# Altium schematic sheet S3220A3.SchDoc: Modem BG95
size A3; Revision: A; SheetNumber: 3; SheetTotal: 5
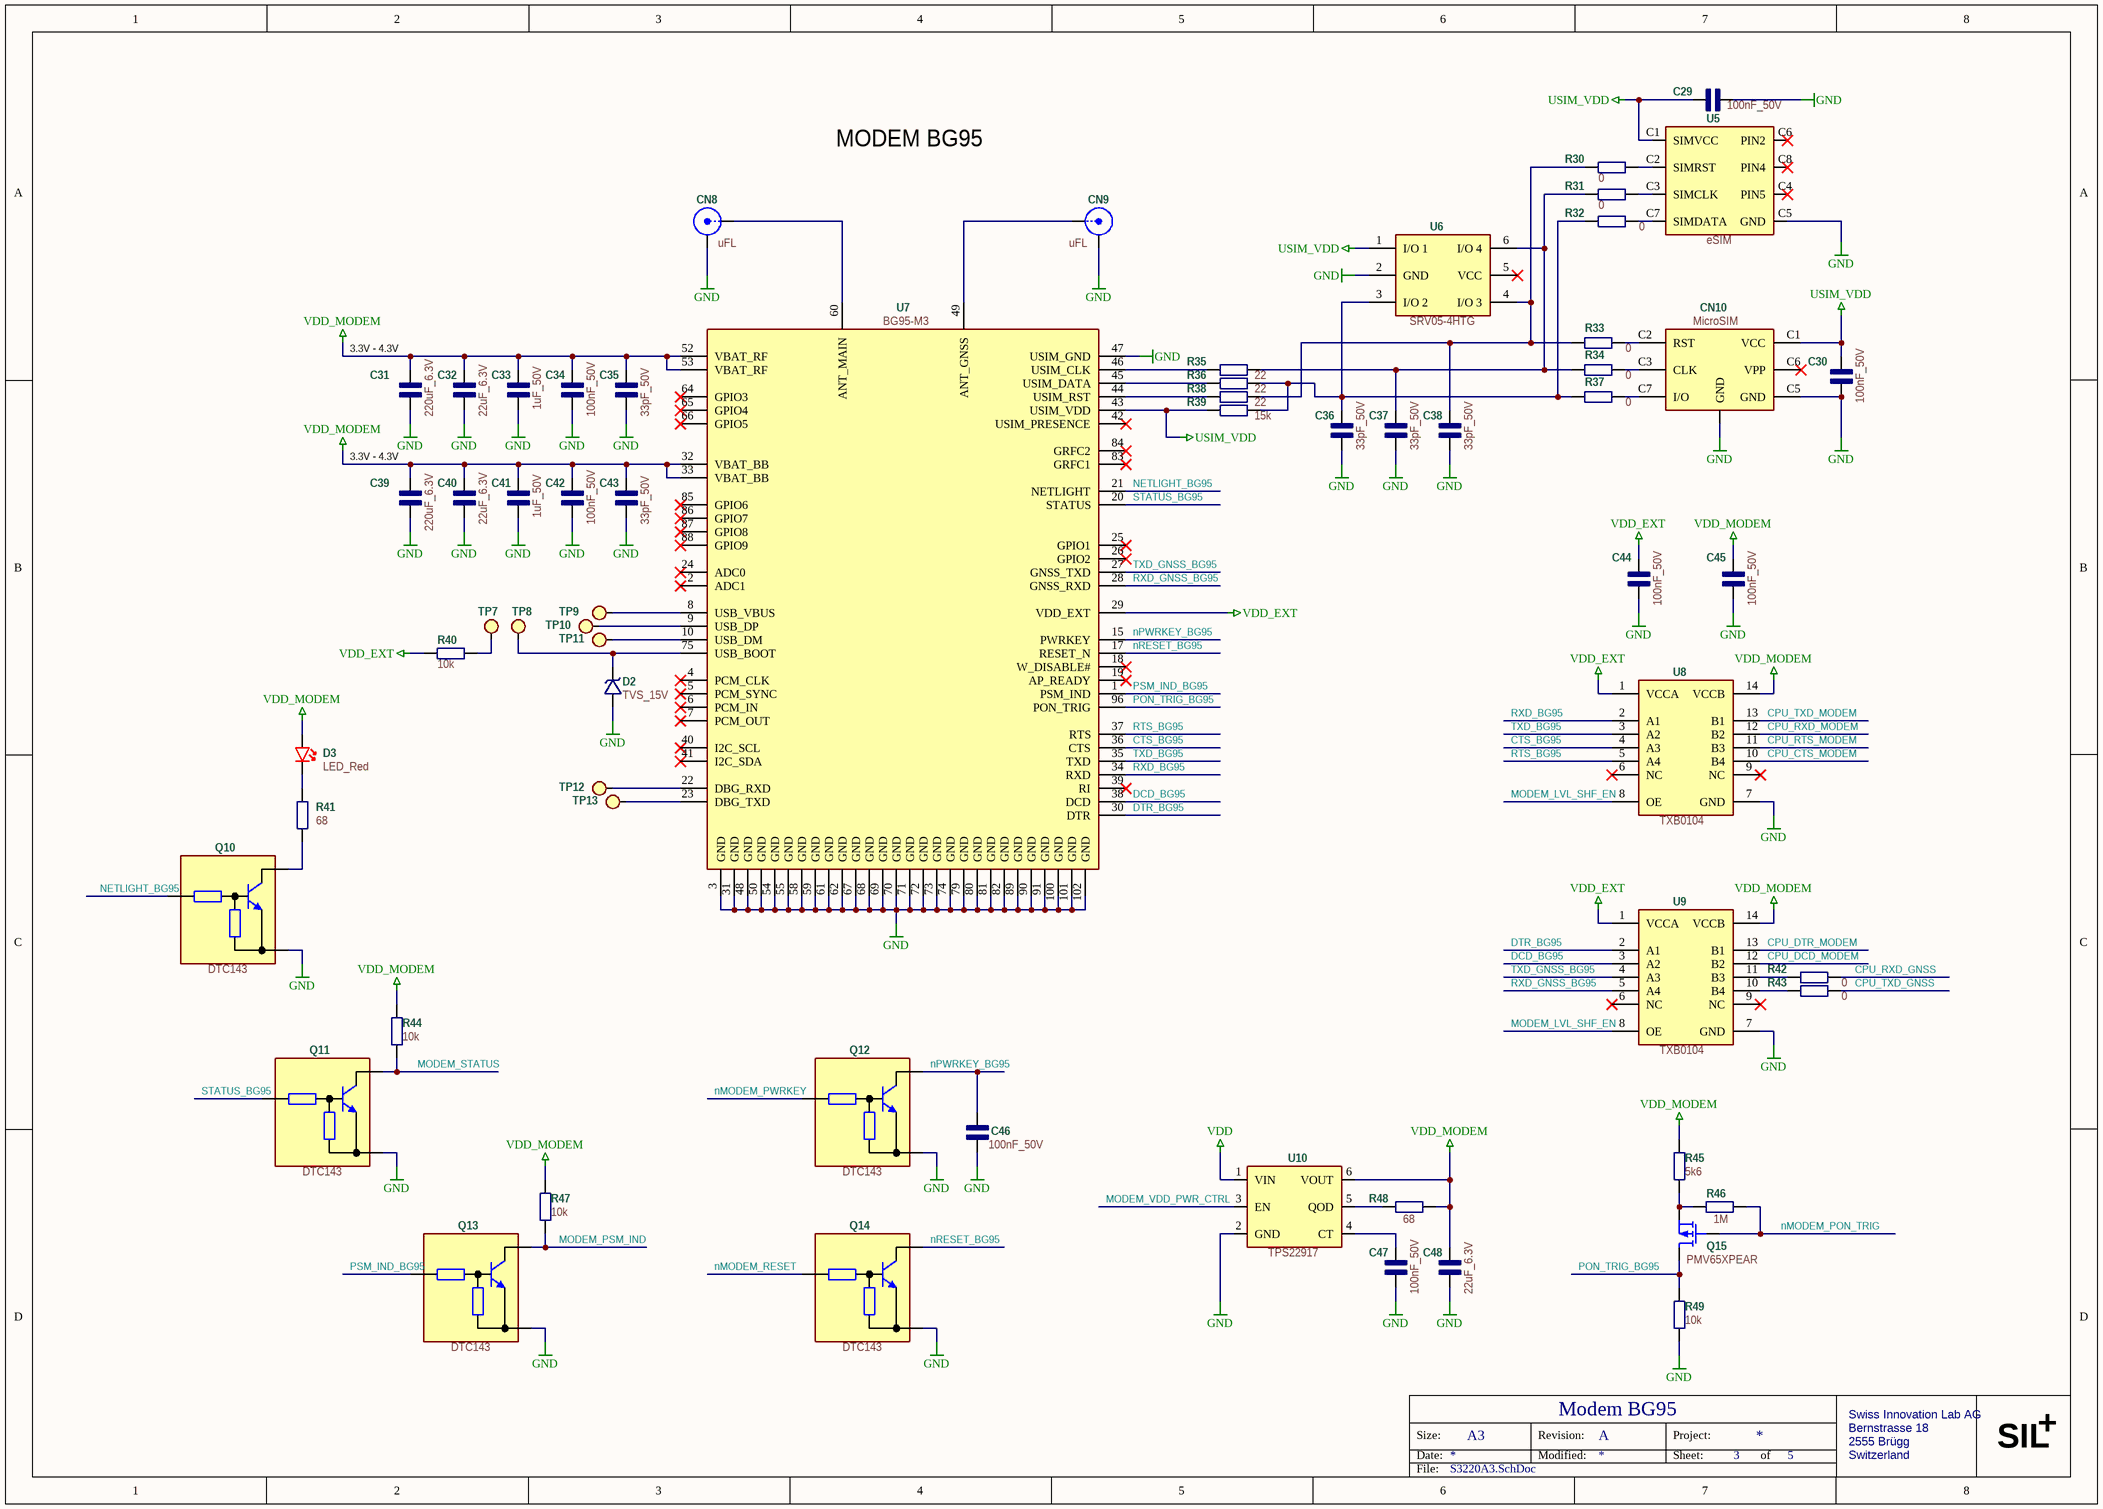
[diagram p0: S3220A3.SchDoc]

## Parts
C29  100nF_50V  [C_0603]
C30  100nF_50V  [C_0603]
C31  220uF_6.3V  [C_1206]
C32  22uF_6.3V  [C_0603]
C33  1uF_50V  [C_0603]
C34  100nF_50V  [C_0603]
C35  33pF_50V  [C_0603]
C36  33pF_50V  [C_0603]
C37  33pF_50V  [C_0603]
C38  33pF_50V  [C_0603]
C39  220uF_6.3V  [C_1206]
C40  22uF_6.3V  [C_0603]
C41  1uF_50V  [C_0603]
C42  100nF_50V  [C_0603]
C43  33pF_50V  [C_0603]
C44  100nF_50V  [C_0603]
C45  100nF_50V  [C_0603]
C46  100nF_50V  [C_0603]
C47  100nF_50V  [C_0603]
C48  22uF_6.3V  [C_0603]
CN8  uFL  [CN_RF_uFL]
CN9  uFL  [CN_RF_uFL]
CN10  MicroSIM  [CN_MicroSIM-Holder]
D2  TVS_15V  [D_0603]
D3  LED_Red  [LED_0603]
Q10  DTC143  [Q_SOT-416]
Q11  DTC143  [Q_SOT-416]
Q12  DTC143  [Q_SOT-416]
Q13  DTC143  [Q_SOT-416]
Q14  DTC143  [Q_SOT-416]
Q15  PMV65XPEAR  [U_SOT23-3]
R30  0  [R_0603]
R31  0  [R_0603]
R32  0  [R_0603]
R33  0  [R_0603]
R34  0  [R_0603]
R35  22  [R_0603]
R36  22  [R_0603]
R37  0  [R_0603]
R38  22  [R_0603]
R39  15k  [R_0603]
R40  10k  [R_0603]
R41  68  [R_0603]
R42  0  [R_0603]
R43  0  [R_0603]
R44  10k  [R_0603]
R45  5k6  [R_0603]
R46  1M  [R_0603]
R47  10k  [R_0603]
R48  68  [R_0603]
R49  10k  [R_0603]
TP7  Test point  [TP_SMD_R1.0mm]  (value not drawn)  (no BOM)
TP8  Test point  [TP_SMD_R1.0mm]  (value not drawn)  (no BOM)
TP9  Test point  [TP_SMD_R1.0mm]  (value not drawn)  (no BOM)
TP10  Test point  [TP_SMD_R1.0mm]  (value not drawn)  (no BOM)
TP11  Test point  [TP_SMD_R1.0mm]  (value not drawn)  (no BOM)
TP12  Test point  [TP_SMD_R1.0mm]  (value not drawn)  (no BOM)
TP13  Test point  [TP_SMD_R1.0mm]  (value not drawn)  (no BOM)
U5  eSIM  [U_MFF2]
U6  SRV05-4HTG  [U_SOT23-6]
U7  BG95-M3  [U_BG96_BG95]
U8  TXB0104  [U_14-VQFN]
U9  TXB0104  [U_14-VQFN]
U10  TPS22917  [U_SOT23-6]

## Nets
GND: C29.1 C30.1 C31.1 C32.1 C33.2 C34.1 C35.1 C36.1 C37.1 C38.1 C39.1 C40.1 C41.2 C42.1 C43.1 C44.2 C45.2 C46.1 C47.1 C48.1 CN8.G CN9.G CN10.0(GND) CN10.C5(GND) D2.1 Q10.2(E) Q11.2(E) Q12.2(E) Q13.2(E) Q14.2(E) R49.2 U5.C5(GND) U6.2(GND) U7.3(GND) U7.31(GND) U7.47(USIM_GND) U7.48(GND) U7.50(GND) U7.54(GND) U7.55(GND) U7.58(GND) U7.59(GND) U7.61(GND) U7.62(GND) U7.67(GND) U7.68(GND) U7.69(GND) U7.70(GND) U7.71(GND) U7.72(GND) U7.73(GND) U7.74(GND) U7.79(GND) U7.80(GND) U7.81(GND) U7.82(GND) U7.89(GND) U7.90(GND) U7.91(GND) U7.100(GND) U7.101(GND) U7.102(GND) U8.7(GND) U9.7(GND) U10.2(GND)
USIM_VDD: C29.2 C30.2 CN10.C1(VCC) R39.1 U5.C1(SIMVCC) U6.1(I/O_1) U7.43(USIM_VDD)
VDD: U10.1(VIN)
VDD_EXT: C44.1 R40.1 U7.29(VDD_EXT) U8.1(VCCA) U9.1(VCCA)
VDD_MODEM: C31.2 C32.2 C33.1 C34.2 C35.2 C39.2 C40.2 C41.1 C42.2 C43.2 C45.1 C48.2 D3.1(A) R44.1 R45.2 R47.1 R48.2 U7.32(VBAT_BB) U7.33(VBAT_BB) U7.52(VBAT_RF) U7.53(VBAT_RF) U8.14(VCCB) U9.14(VCCB) U10.6(VOUT)
CPU_CTS_MODEM: U8.10(B4)
CPU_DCD_MODEM: U9.12(B2)
CPU_DTR_MODEM: U9.13(B1)
CPU_RTS_MODEM: U8.11(B3)
CPU_RXD_GNSS: R42.2
CPU_RXD_MODEM: U8.12(B2)
CPU_TXD_GNSS: R43.2
CPU_TXD_MODEM: U8.13(B1)
CTS_BG95: U7.36(CTS) U8.4(A3)
DCD_BG95: U7.38(DCD) U9.3(A2)
DTR_BG95: U7.30(DTR) U9.2(A1)
MODEM_LVL_SHF_EN: U8.8(OE) U9.8(OE)
MODEM_PSM_IND: Q13.3(C) R47.2
MODEM_STATUS: Q11.3(C) R44.2
MODEM_VDD_PWR_CTRL: U10.3(EN)
NETLIGHT_BG95: Q10.1(B) U7.21(NETLIGHT)
nMODEM_PON_TRIG: Q15.1(G) R46.1
nMODEM_PWRKEY: Q12.1(B)
nMODEM_RESET: Q14.1(B)
nPWRKEY_BG95: C46.2 Q12.3(C) U7.15(PWRKEY)
nRESET_BG95: Q14.3(C) U7.17(RESET_N)
PON_TRIG_BG95: Q15.3(D) R49.1 U7.96(PON_TRIG)
PSM_IND_BG95: Q13.1(B) U7.1(PSM_IND)
RTS_BG95: U7.37(RTS) U8.5(A4)
RXD_BG95: U7.34(RXD) U8.2(A1)
RXD_GNSS_BG95: U7.28(GNSS_RXD) U9.5(A4)
STATUS_BG95: Q11.1(B) U7.20(STATUS)
TXD_BG95: U7.35(TXD) U8.3(A2)
TXD_GNSS_BG95: U7.27(GNSS_TXD) U9.4(A3)
NetC36_2: C36.2 R32.2 R36.2 R37.1 R39.2 U6.3(I/O_2)
NetC37_2: C37.2 R31.2 R34.1 R35.2 U6.6(I/O_4)
NetC38_2: C38.2 R30.2 R33.1 R38.2 U6.4(I/O_3)
NetC47_2: C47.2 U10.4(CT)
NetCN8_S: CN8.S U7.60(ANT_MAIN)
NetCN9_S: CN9.S U7.49(ANT_GNSS)
NetCN10_C2: CN10.C2(RST) R33.2
NetCN10_C3: CN10.C3(CLK) R34.2
NetCN10_C7: CN10.C7(I/O) R37.2
NetD2_2: D2.2 TP8.1 U7.75(USB_BOOT)
NetD3_2: D3.2(K) R41.2
NetQ10_3: Q10.3(C) R41.1
NetQ15_2: Q15.2(S) R45.1 R46.2
NetR30_1: R30.1 U5.C2(SIMRST)
NetR31_1: R31.1 U5.C3(SIMCLK)
NetR32_1: R32.1 U5.C7(SIMDATA)
NetR35_1: R35.1 U7.46(USIM_CLK)
NetR36_1: R36.1 U7.45(USIM_DATA)
NetR38_1: R38.1 U7.44(USIM_RST)
NetR40_2: R40.2 TP7.1
NetR42_1: R42.1 U9.11(B3)
NetR43_1: R43.1 U9.10(B4)
NetR48_1: R48.1 U10.5(QOD)
NetTP9_1: TP9.1 U7.8(USB_VBUS)
NetTP10_1: TP10.1 U7.9(USB_DP)
NetTP11_1: TP11.1 U7.10(USB_DM)
NetTP12_1: TP12.1 U7.22(DBG_RXD)
NetTP13_1: TP13.1 U7.23(DBG_TXD)

Not connected (* = marked no-connect by the designer): CN10 C6(VPP)* X1 X2; U5 C4(PIN5)* C6(PIN2)* C8(PIN4)* NC; U6 5(VCC)*; U7 2(ADC1)* 4(PCM_CLK)* 5(PCM_SYNC)* 6(PCM_IN)* 7(PCM_OUT)* 11(RESERVED) 12(RESERVED) 13(RESERVED) 14(RESERVED) 16(RESERVED) 18(W_DISABLE#)* 19(AP_READY)* 24(ADC0)* 25(GPIO1)* 26(GPIO2)* 39(RI)* 40(I2C_SCL)* 41(I2C_SDA)* 42(USIM_PRESENCE)* 51(RESERVED) 56(RESERVED) 57(RESERVED) 63(RESERVED) 64(GPIO3)* 65(GPIO4)* 66(GPIO5)* 76(RESERVED) 77(RESERVED) 78(RESERVED) 83(GRFC1)* 84(GRFC2)* 85(GPIO6)* 86(GPIO7)* 87(GPIO8)* 88(GPIO9)* 92(RESERVED) 93(RESERVED) 94(RESERVED) 95(RESERVED) 97(RESERVED) 98(RESERVED) 99(RESERVED); U8 6(NC)* 9(NC)*; U9 6(NC)* 9(NC)*

## Notes on the sheet
- MODEM BG95
- (near C31) 3.3V - 4.3V
- (near C39) 3.3V - 4.3V
- Size:
- Date:
- A3
- Revision:
- Modified:
- Project:
- Sheet:
- of
- Swiss Innovation Lab AG
- Bernstrasse 18
- 2555 Brügg
- Switzerland
- SIL
- +
- File:

## Library data of the parts
C29 C30 C34 C42 C44-C47 = C_100nF_50V: 0.1µF ±10% 50V Ceramic Capacitor X7R 0603 (1608 Metric); Manufacturer: TDK; Manufacturer Part Number: C1608X7R1H104K080AA; Value: 100nF; ValueAux: _50V; Currency: $; Price: 0,01309; Supplier 1: Digi-Key; Supplier Part Number 1: 445-1314-6-ND
C31 C39 = C_220uF_6.3V: 220µF ±20% 6.3V Ceramic Capacitor X5R 1206 (3216 Metric); Manufacturer: Murata Electronics North America; Manufacturer Part Number: GRM31CR60J227ME11L; Value: 220uF; ValueAux: _6.3V; Currency: $; Price: 0,59945; Supplier 1: Digi-Key; Supplier Part Number 1: 490-13970-1-ND
C32 C40 C48 = C_22uF_6V3: 22µF ±20% 6.3V Ceramic Capacitor X5R 0603 (1608 Metric); Manufacturer: Samsung Electro-Mechanics; Manufacturer Part Number: CL10A226MQ8NRNC; Value: 22uF; ValueAux: _6.3V; Currency: $; Price: 0,04566; Supplier 1: Digi-Key; Supplier Part Number 1: 1276-1193-1-ND
C33 C41 = C_1uF_50V: 1µF 50V Ceramic Capacitor X5R 0603 (1608 Metric) 0.063" L x 0.032" W (1.60mm x 0.80mm); Manufacturer: Samsung Electro-Mechanics; Manufacturer Part Number: CL10A105KB8NNNC; Value: 1uF; ValueAux: _50V; Currency: $; Price: 0,03472; Supplier 1: Digi-Key; Supplier Part Number 1: 1276-1860-1-ND
C35-C38 C43 = C_33pF_50V: 33pF ±1% 50V Ceramic Capacitor C0G, NP0 0603 (1608 Metric); Manufacturer: Samsung Electro-Mechanics; Manufacturer Part Number: CL10C330FB8NNNC; ValueAux: _50V; Currency: $; Value: 33pF; Price: 0,04166; Supplier 1: Digi-Key; Supplier Part Number 1: 1276-2262-6-ND
CN8 CN9 = CN_RF_uFL: Ultra Miniature Coaxial Connector Jack, Male Pin 50 Ohm Surface Mount Solder; Manufacturer: TE Connectivity AMP Connectors; Manufacturer Part Number: 1909763-1; Currency: $; Value: uFL; Price: 0,25410; Supplier 1: Digi-Key; Supplier Part Number 1: A118077CT-ND
CN10 = CN_MicroSIM-Holder: 6 Position Card Connector Micro SIM Surface Mount, Right Angle Gold; Manufacturer: Molex LLC; Manufacturer Part Number: 0788000001; Currency: $; Value: MicroSIM; Price: 1,14178; Supplier 1: Digi-Key; Supplier Part Number 1: WM9786CT-ND
D2 = D_TVS_15V: TVS DIODE 15V 27.4V DSN1608-2; Manufacturer: Nexperia USA Inc.; Manufacturer Part Number: PTVS15VZ1USKYL; ValueAux: _15V; Currency: $; Value: TVS; Price: 0,09950; Supplier 1: Digi-Key; Supplier Part Number 1: 1727-2745-6-ND
D3 = D_LED_R_5mA: Red 631nm LED Indication - Discrete 2V 0603; Manufacturer: Lite-On Inc.; Manufacturer Part Number: LTST-C193KRKT-5A; ValueAux: _Red; Currency: $; Value: LED; Price: 0,07565; Supplier 1: Digi-Key; Supplier Part Number 1: 160-1830-1-ND
Q10-Q14 = Q_DTC143: Pre-Biased Bipolar Transistor (BJT) NPN - Pre-Biased 50V 100mA  200mW Surface Mount SC-75, SOT-416; Manufacturer: ON Semiconductor; Manufacturer Part Number: DTC143ZET1G; Currency: $; Value: DTC143; Price: 0,03338; Supplier 1: Digi-Key; Supplier Part Number 1: DTC143ZET1GOSCT-ND
Q15 = Q_PMV65: P-Channel 20V 2.8A (Ta) 480mW (Ta), 6.25W (Tc) Surface Mount TO-236AB (SOT23); Manufacturer: Nexperia USA Inc.; Currency: $; Value: PMV65XPEAR; Manufacturer Part Number: PMV65XPEAR; Price: 0,11204; Supplier 1: Digi-Key; Supplier Part Number 1: 1727-2310-1-ND
R30-R34 R37 R42 R43 = R_0_1%: 0 Ohms Jumper 0.1W, 1/10W Chip Resistor 0603 (1608 Metric) Automotive AEC-Q200 Thick Film; Manufacturer: Panasonic Electronic Components; Manufacturer Part Number: ERJ-3GEY0R00V; Currency: $; Value: 0; Price: 0,00962; Supplier 1: Digi-Key; Supplier Part Number 1: P0.0GCT-ND
R35 R36 R38 = R_22_1%: 22 Ohms ±1% 0.1W, 1/10W Chip Resistor 0603 (1608 Metric) Automotive AEC-Q200 Thick Film; Manufacturer: Panasonic Electronic Components; Manufacturer Part Number: ERJ-3EKF22R0V; Currency: $; Value: 22; Price: 0,01153; Supplier 1: Digi-Key; Supplier Part Number 1: P22.0HCT-ND
R39 = R_15k_1%: 15 kOhms ±1% 0.1W, 1/10W Chip Resistor 0603 (1608 Metric) Automotive AEC-Q200, Moisture Resistant Thick Film; Manufacturer: Yageo; Manufacturer Part Number: AC0603FR-0715KL; Currency: $; Value: 15k; Price: 0,00527; Supplier 1: Digi-Key; Supplier Part Number 1: YAG3569DKR-ND
R40 R44 R47 R49 = R_10k_1%: 10 kOhms ±1% 0.1W, 1/10W Chip Resistor 0603 (1608 Metric) Automotive AEC-Q200 Thick Film; Manufacturer: Panasonic Electronic Components; Manufacturer Part Number: ERJ-3EKF1002V; Currency: $; Value: 10k; Price: 0,01449; Supplier 1: Digi-Key; Supplier Part Number 1: P10.0KHCT-ND
R41 R48 = R_68_1%: 68 Ohms ±1% 0.1W, 1/10W Chip Resistor 0603 (1608 Metric) Automotive AEC-Q200 Thick Film; Manufacturer: Panasonic Electronic Components; Manufacturer Part Number: ERJ-3EKF68R0V; Currency: $; Value: 68; Price: 0,01449; Supplier 1: Digi-Key; Supplier Part Number 1: P68.0HCT-ND
R45 = R_5k6_1%: 5.6 kOhms ±1% 0.1W, 1/10W Chip Resistor 0603 (1608 Metric) Automotive AEC-Q200 Thick Film; Manufacturer: Panasonic Electronic Components; Manufacturer Part Number: ERJ-3EKF5601V; Currency: $; Value: 5k6; Price: 0,01264; Supplier 1: Digi-Key; Supplier Part Number 1: P5.60KHCT-ND
R46 = R_1M_1%: 1 MOhms ±1% 0.1W, 1/10W Chip Resistor 0603 (1608 Metric) Automotive AEC-Q200 Thick Film; Manufacturer: Panasonic Electronic Components; Manufacturer Part Number: ERJ-3EKF1004V; Currency: $; Value: 1M; Price: 0,01264; Supplier 1: Digi-Key; Supplier Part Number 1: P1.00MHCT-ND
TP7-TP13 = TP_Test_point: Manufacturer: Swiss Innovation Lab; Currency: $; Value: Test point; Manufacturer Part Number: Test point; Price: 0
U5 = U_eSIM-M2M: M2M embedded SIM card IC; Manufacturer: 1NCE; Currency: $; Value: eSIM; Manufacturer Part Number: eSIM; Price: 12,0; Supplier 1: 1NCE; Supplier Part Number 1: eSIM
U6 = U_SRV05-4HTG: TVS DIODE 6V 15V SOT23-6; Manufacturer: Littelfuse Inc.; Currency: $; Value: SRV05-4HTG; Manufacturer Part Number: SRV05-4HTG; Price: 0,40556; Supplier 1: Digi-Key; Supplier Part Number 1: F4204CT-ND
U7 = U_BG95: MultiBand, 3GPP Rel.13, LTE Cat.M1/NB1, GSM/EGPRS, 3xUART, VoLTE; Manufacturer: Quectel; Currency: $; Value: BG95-M3; Manufacturer Part Number: BG95-M3; Price: 15,98590; Supplier 1: Codico; Supplier Part Number 1: BG95-M3
U8 U9 = U_TXB0104: Voltage Level Translator Bidirectional 1 Circuit 4 Channel 100Mbps 14-VQFN (3.5x3.5); Manufacturer: Texas Instruments; Manufacturer Part Number: TXB0104RGYR; Currency: $; Value: TXB0104; Price: 0,65817; Supplier 1: Digi-Key; Supplier Part Number 1: 296-21930-6-ND
U10 = U_TPS22917: Power Switch/Driver 1:1 P-Channel 2A SOT-23-6; Manufacturer: Texas Instruments; Manufacturer Part Number: TPS22917DBVR; Currency: $; Value: TPS22917; Price: 0,19065; Supplier 1: Digi-Key; Supplier Part Number 1: 296-50498-1-ND